# Altium schematic sheet Regelaar.SchDoc
size A4; SheetNumber: 4; SheetTotal: 5
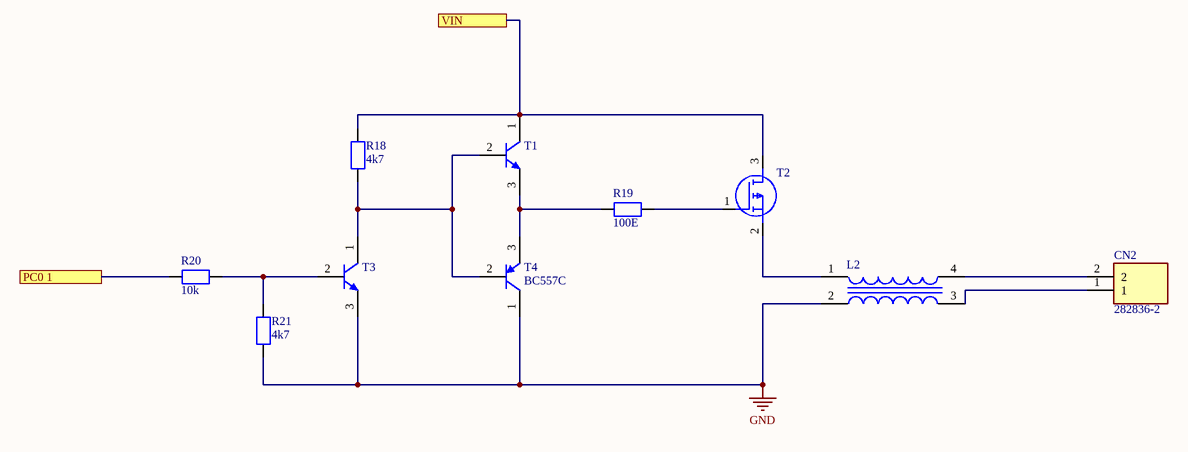
[diagram p0: Regelaar.SchDoc]

## Parts
CN2  282836-2  [Schroefconnector 2 Pin]
L2  Smoorspoel commom mode  [smoorspoel Common mode]  (value not drawn)
R18  4k7  [Resistor]
R19  100E  [Resistor]
R20  10k  [Resistor]
R21  4k7  [Resistor]
T1  BC547CZL1G  [BC547C]  (value not drawn)
T2  MOSFET  [MOSFET]  (value not drawn)
T3  BC547CZL1G  [BC547C]  (value not drawn)
T4  BC557C  [BC557C]

## Ports
PC0 1 (see CPU[1B]), VIN (see Voeding[3B])

## Nets
GND: L2.2(SEC+) R21.1 T3.3(E) T4.1(C)
PC0 1: R20.1 ; port PC0 1
VIN: R18.2 T1.1(C) T2.3(D) ; port VIN
NetCN2_1: CN2.1 L2.3(SEC-)
NetCN2_2: CN2.2 L2.4(PRI-)
NetL2_1: L2.1(PRI+) T2.2(S)
NetR18_1: R18.1 T1.2(B) T3.1(C) T4.2(B)
NetR19_1: R19.1 T1.3(E) T4.3(E)
NetR19_2: R19.2 T2.1(G)
NetR20_2: R20.2 R21.2 T3.2(B)

## Library data of the parts
CN2 = Schroefconnector 2 Pin L: Connector; Manufacturer_Name: TE Connectivity; Datasheet Link: https://www.te.com/commerce/DocumentDelivery/DDEController?Action=showdoc&DocId=Customer+Drawing%7F282836%7FJ%7Fpdf%7FEnglish%7FENG_CD_282836_J.pdf%7F282836-2; Height: 10mm; Manufacturer_Part_Number: 282836-2
L2 = Smoorspoel commom mode: Transformer CM2545X171B-10; Manufacturer_Name: Laird Technologies; Datasheet Link: https://datasheet.datasheetarchive.com/originals/dk/DKDS-7/122753.pdf; Height: 9.5mm; Manufacturer_Part_Number: CM2545X171B-10
R18-R21 = Resistor: Manufacturer: Vishay Dale; Part Number: CRCW08050000Z0EA
T1 T3 = BC547C: BC547C, 45 V, 100 mA, 500 mW, / hfe = 400; Manufacturer: On Semiconductor; IC Continuous (A): 0.1; Packing: Ammo Box; Polarity: NPN; fT Min (MHz): 150; PackageDescription: 3-Pin Transistor Outline, Body 4.825 x 3.685 mm, Pitch 1.27 mm; ComponentLink2Description: Datasheet; PackageVersion: Rev. AM; DatasheetVersion: Rev. 7; Mounting Technology: Through Hole; ComponentLink3Description: Package Specification; PartNumber: BC547CZL1G; ComponentLink1Description: Manufacturer URL; PackageReference: TO-92-3-29-11_AM_BL; ComponentLink1URL: http://www.onsemi.com/; RoHS: TRUE; ComponentLink3URL: http://www.onsemi.com/pub_link/Collateral/MAC97-D.PDF; ComponentLink2URL: http://www.onsemi.com/pub_link/Collateral/BC546-D.PDF
T2 = MOSFET: P-MOSFET, 55 V, 17 A, / 100 mΩ
T4 = BC557C: 45 V, –100 mA, 500 mW, / hfe = 400; Manufacturer: On Semiconductor; Polarity: PNP; IC Continuous (A): -0.1; Packing: Bulk Box; PartNumber: BC557C; PackageVersion: Rev. AM; RoHS: FALSE; PackageDescription: 3-Pin Transistor Outline, Body 4.825 x 3.685 mm, Pitch 1.27 mm; ComponentLink2Description: Datasheet; DatasheetVersion: Rev. 3; ComponentLink3Description: Package Specification; Mounting Technology: Through Hole; ComponentLink2URL: http://www.onsemi.com/pub_link/Collateral/BC556B-D.PDF; ComponentLink1URL: http://www.onsemi.com/; ComponentLink1Description: Manufacturer URL; ComponentLink3URL: http://www.onsemi.cn/pub_link/Collateral/2N6426-D.PDF; PackageReference: TO-92-3-29-11_AM_SL